# EAGLE schematic BLE -- HM-10 -- Carduino Breakout v1.0.2 (EAGLE 6.5.0)
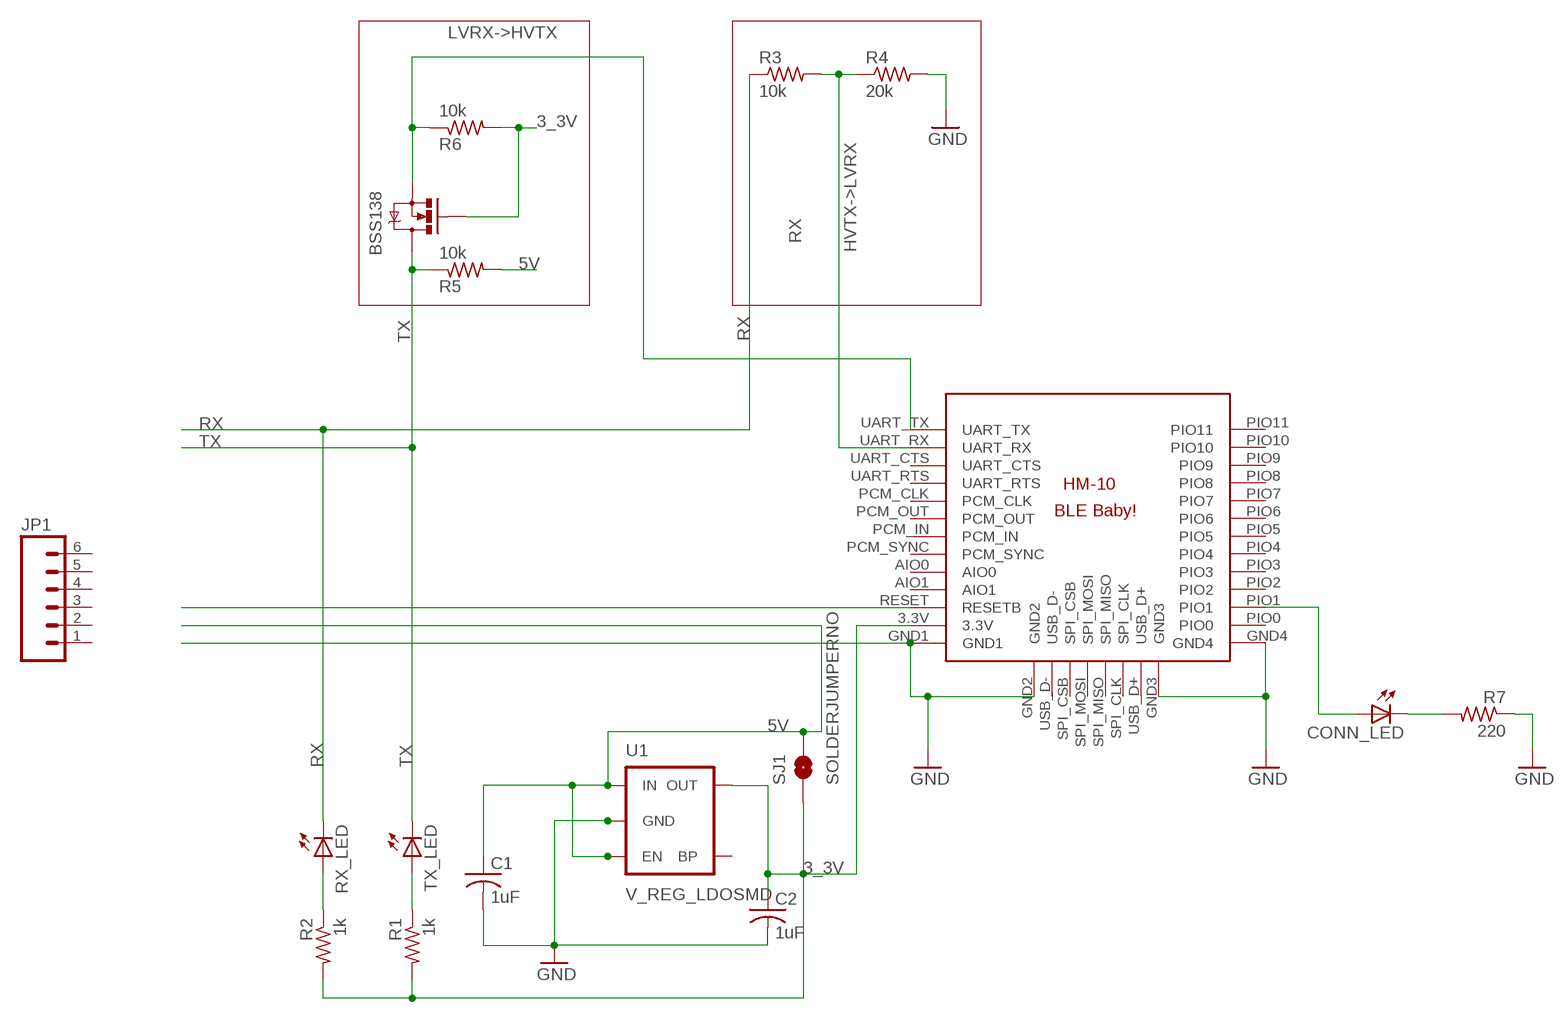
[diagram p0: schematic, sheet 1]

## Parts
BSS138  MOSFET-NCHANNELSMD  [SOT23-3]
C1  1uF  C-USC0805K  [C0805K]
C2  1uF  C-USC0805K  [C0805K]
CONN_LED  LED0603  [LED-0603]
JP1  M06SIP  [1X06]
R1  1k  R-US_M0805  [M0805]
R2  1k  R-US_M0805  [M0805]
R3  10k  R-US_M0805  [M0805]
R4  20k  R-US_M0805  [M0805]
R5  10k  R-US_M0805  [M0805]
R6  10k  R-US_M0805  [M0805]
R7  220  R-US_M0805  [M0805]
RX_LED  LED0603  [LED-0603]
SJ1  SOLDERJUMPERNO  [SJ_2S-NO]
TX_LED  LED0603  [LED-0603]
U1  V_REG_LDOSMD  [SOT23-5]
U$1  BLE-HM-10  [BLE-HM-10]

## Nets
3_3V: BSS138.1(G) C2.1 R1.2 R2.2 R6.2 SJ1.1 U1.5(OUT) U$1.3.3V
5V: C1.1 R5.2 SJ1.2 U1.1(IN) U1.3(EN)
GND: C1.2 C2.2 R4.2 R7.1 U1.2(GND) U$1.GND1 U$1.GND2 U$1.GND3 U$1.GND4
HVTX->LVRX: R3.2 R4.1 U$1.UART_RX
LVRX->HVTX: BSS138.2(S) R6.1 U$1.UART_TX
N$2: CONN_LED.A U$1.PIO1
N$3: U$1.RESET(RESETB)
N$24: R1.1 TX_LED.A
N$26: CONN_LED.C R7.2
N$27: R2.1 RX_LED.A
RX: R3.1 RX_LED.C
TX: BSS138.3(D) R5.1 TX_LED.C
Unconnected: JP1.1 JP1.2 JP1.3 JP1.4 JP1.5 JP1.6 U1.4(BP) U$1.AIO0 U$1.AIO1 U$1.PCM_CLK U$1.PCM_IN U$1.PCM_OUT U$1.PCM_SYNC U$1.PIO0 U$1.PIO2 U$1.PIO3 U$1.PIO4 U$1.PIO5 U$1.PIO6 U$1.PIO7 U$1.PIO8 U$1.PIO9 U$1.PIO10 U$1.PIO11 U$1.SPI_CLK U$1.SPI_CSB U$1.SPI_MISO U$1.SPI_MOSI U$1.UART_CTS U$1.UART_RTS U$1.USB_D+ U$1.USB_D-

## Library data of the parts
BSS138 = SparkFun:MOSFET-NCHANNEL
C1 C2 = resistor:C-US: CAPACITOR, American symbol
CONN_LED RX_LED TX_LED = SparkFun:LED: LEDs Standard schematic elements and footprints for 5mm, 3mm, 1206, and 0603 sized LEDs. 5mm - Spark Fun Electronics SKU : COM-00529 (and others)
JP1 = SparkFun-Connectors:M06: Header 6 Standard 6-pin 0.1" header. Use with straight break away headers (SKU : PRT-00116), right angle break away headers (PRT-00553), swiss pins (PRT-00743), machine pins (PRT-00117), and female headers (PRT-00115). Molex polarized connector foot print use with SKU : PRT-08094 with associated crimp pins and housings. NOTES ON THE VARIANTS LOCK and LOCK_LONGPADS... This footprint was designed to help hold the alignment of a through-hole component (i.e. 6-pin header) while soldering it into place. You may notice that each hole has been shifted either up or down by 0.005 of an inch from it's more standard position (which is a perfectly straight line). This slight alteration caused the pins (the squares in the middle) to touch the edges of the holes. Because they are alternating, it causes a "brace" to hold the component in place. 0.005 has proven to be the perfect amount of "off-center" position when using our standard breakaway headers. Although looks a little odd when you look at the bare footprint, once you have a header in there, the alteration is very hard to notice. Also,if you push a header all the way into place, it is covered up entirely on the bottom side. This idea of altering the position of holes to aid alignment will be further integrated into the Sparkfun Library for other footprints. It can help hold any component with 3 or more connection pins.
R1-R7 = resistor:R-US_: RESISTOR, American symbol
SJ1 = SparkFun:SOLDERJUMPER: Solder Jumper Standard SMD solder jumper. Used to automate production. Two varients : Normally Open and Normally Closed are the same, but have different paste layers. NC will have a large amount of paste and should jumper during reflow.
U1 = SparkFun:V_REG_LDO: Voltage Regulator LDO Standard 150mA LDO voltage regulator in SOT-23 layout. Micrel part MIC5205. BP (by-pass) pin is used to lower output noise with 470pF cap.
U$1 = Random parts:BLE-HM-10